# EAGLE schematic Rev B (EAGLE 6.5.0)

## Sheet 1 of 2
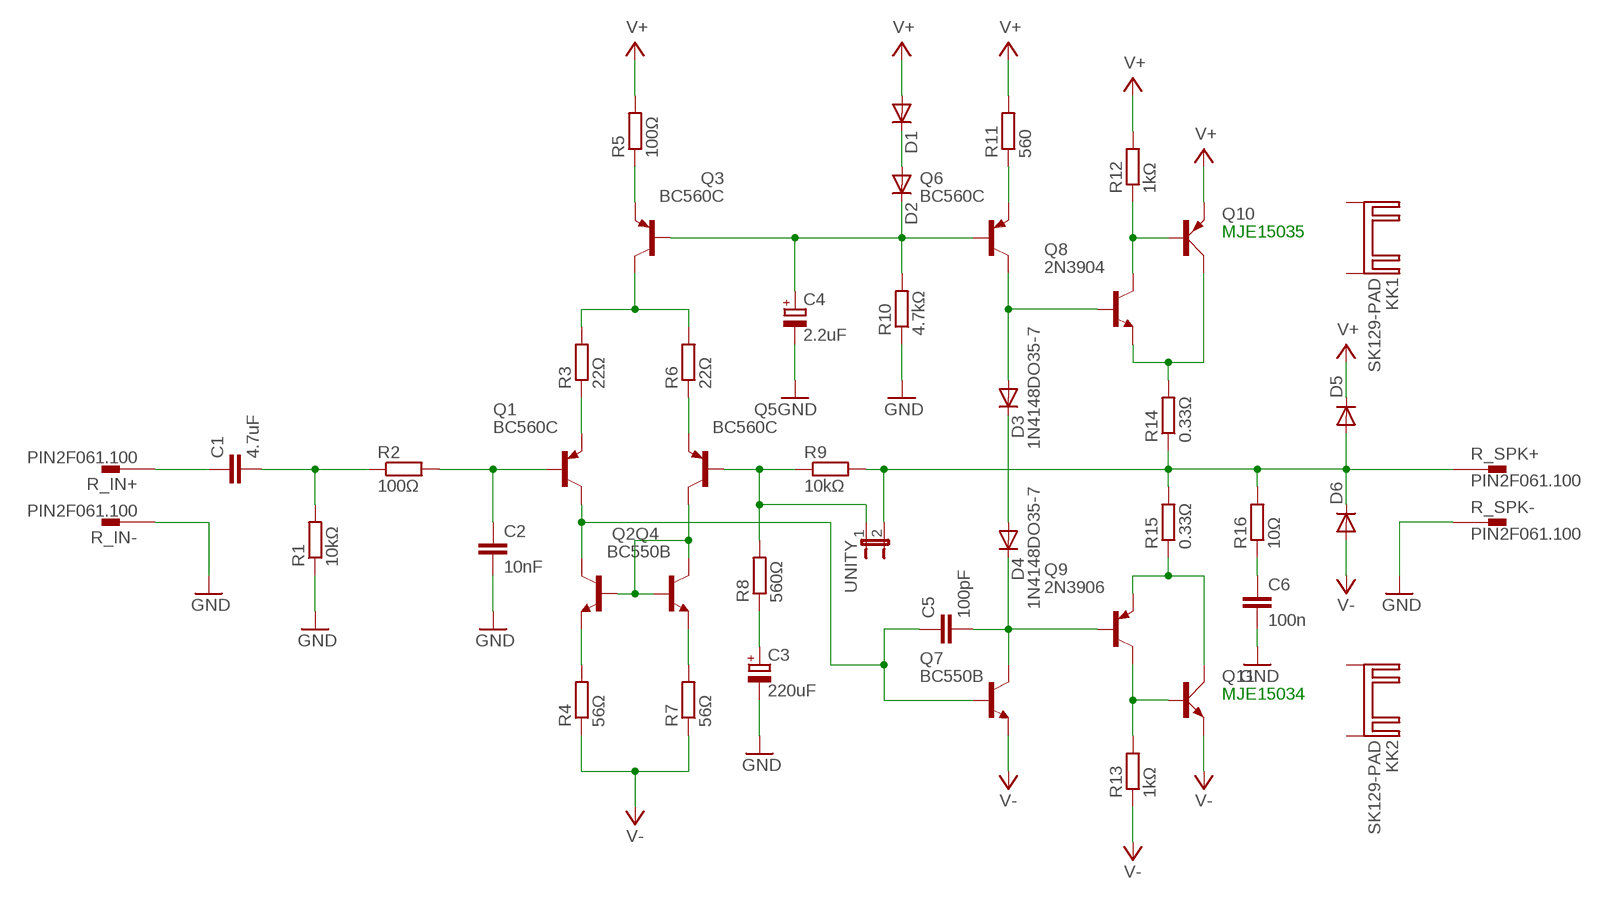
[diagram p0: schematic, sheet 1]

### Parts
C1  4.7uF  C-EU225-113X268  [C225-113X268]
C2  10nF  C-EU025-025X050  [C025-025X050]
C3  220uF  CPOL-EUE3.5-8  [E3,5-8]
C4  2.2uF  CPOL-EUE2-5  [E2-5]
C5  100pF  C-EU050-050X075  [C050-050X075]
C6  100n  C-EU075-042X103  [C075-042X103]
D1  1N4148DO35-7  [DO35-7]
D2  1N4148DO35-7  [DO35-7]
D3  1N4148DO35-7  [DO35-7]
D4  1N4148DO35-7  [DO35-7]
D5  1N4148DO35-7  [DO35-7]
D6  1N4148DO35-7  [DO35-7]
KK1  SK129-PAD  [SK129]
KK2  SK129-PAD  [SK129]
Q1  BC560C  [TO92-EBC]
Q2  BC550B  [TO92-EBC]
Q3  BC560C  [TO92-EBC]
Q4  BC550B  [TO92-EBC]
Q5  BC560C  [TO92-EBC]
Q6  BC560C  [TO92-EBC]
Q7  BC550B  [TO92-EBC]
Q8  2N3904  [TO92]
Q9  2N3906  [TO92]
Q10  TIP42C  [TO220AV]
Q11  TIP41C  [TO220AV]
R1  10kΩ  R-EU_0207/10  [0207/10]
R2  100Ω  R-EU_0207/10  [0207/10]
R3  22Ω  R-EU_0207/10  [0207/10]
R4  56Ω  R-EU_0207/10  [0207/10]
R5  100Ω  R-EU_0207/10  [0207/10]
R6  22Ω  R-EU_0207/10  [0207/10]
R7  56Ω  R-EU_0207/10  [0207/10]
R8  560Ω  R-EU_0207/10  [0207/10]
R9  10kΩ  R-EU_0207/10  [0207/10]
R10  4.7kΩ  R-EU_0207/10  [0207/10]
R11  560  R-EU_0207/10  [0207/10]
R12  1kΩ  R-EU_0207/10  [0207/10]
R13  1kΩ  R-EU_0207/10  [0207/10]
R14  0.33Ω  R-EU_0309/12  [0309/12]
R15  0.33Ω  R-EU_0309/12  [0309/12]
R16  10Ω  R-EU_0617/5V  [0617V]
R_IN+  PIN2F061.100  [F061.100]
R_IN-  PIN2F061.100  [F061.100]
R_SPK+  PIN2F061.100  [F061.100]
R_SPK-  PIN2F061.100  [F061.100]
UNITY  JP1E  [JP1]

### Nets
GND: C2.2 C3.- C4.- C6.2 R1.1 R10.1 R_IN-.A1 R_IN-.A2 R_SPK-.A1 R_SPK-.A2 ; also sheet 2
N$1: D3.A Q6.C Q8.2(B)
N$2: Q5.E R6.1
N$3: Q2.B Q4.B Q4.C Q5.C
N$4: C2.1 Q1.B R2.2
N$5: C1.2 R1.2 R2.1
N$6: C4.+ D2.C Q3.B Q6.B R10.2
N$7: C1.1 R_IN+.A1 R_IN+.A2
N$8: C5.1 Q1.C Q2.C Q7.B
N$9: D1.C D2.A
N$11: Q6.E R11.1
N$12: C3.+ R8.1
N$13: Q2.E R4.2
N$14: Q4.E R7.2
N$16: C6.1 R16.1
N$18: Q1.E R3.1
N$19: Q3.C R3.2 R6.2
N$20: Q3.E R5.1
N$24: D3.C D4.A
N$26: Q8.1(C) Q10.B R12.1
N$27: Q9.1(C) Q11.B R13.2
N$28: Q9.3(E) Q11.C R15.1
N$29: Q8.3(E) Q10.C R14.2
N$31: C5.2 D4.C Q7.C Q9.2(B)
N$32: Q5.B R8.2 R9.1 UNITY.1
R_OUT: D5.A D6.C R9.2 R14.1 R15.2 R16.2 R_SPK+.A1 R_SPK+.A2 UNITY.2
V+: D1.A D5.C Q10.E R5.2 R11.2 R12.2 ; also sheet 2
V-: D6.A Q7.E Q11.E R4.1 R7.1 R13.1 ; also sheet 2
Unconnected: KK1.A2,5(K) KK1.B2,5(K) KK2.A2,5(K) KK2.B2,5(K)

### Notes on the sheet
- MJE15035
- MJE15034

## Sheet 2 of 2
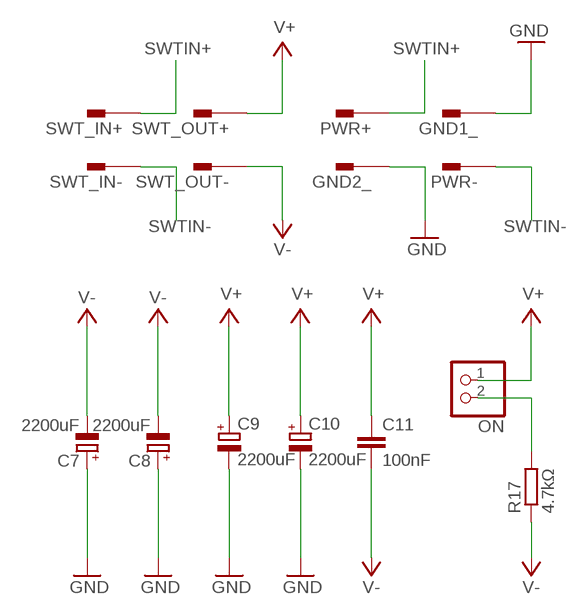
[diagram p1: schematic, sheet 2]

### Parts
C7  2200uF  CPOL-EUE5-10.5  [E5-10,5]
C8  2200uF  CPOL-EUE5-10.5  [E5-10,5]
C9  2200uF  CPOL-EUE5-10.5  [E5-10,5]
C10  2200uF  CPOL-EUE5-10.5  [E5-10,5]
C11  100nF  C-EU025-025X050  [C025-025X050]
GND1_  PIN2F061.100  [F061.100]
GND2_  PIN2F061.100  [F061.100]
ON  JST_2PIN-THM  [JST-PH-2-THM]
PWR+  PIN2F061.100  [F061.100]
PWR-  PIN2F061.100  [F061.100]
R17  4.7kΩ  R-EU_0207/10  [0207/10]
SWT_IN+  PIN2F061.100  [F061.100]
SWT_IN-  PIN2F061.100  [F061.100]
SWT_OUT+  PIN2F061.100  [F061.100]
SWT_OUT-  PIN2F061.100  [F061.100]

### Nets
GND: C7.+ C8.+ C9.- C10.- GND1_.A1 GND1_.A2 GND2_.A1 GND2_.A2 ; also sheet 1
N$10: ON.2 R17.2
SWTIN+: PWR+.A1 PWR+.A2 SWT_IN+.A1 SWT_IN+.A2
SWTIN-: PWR-.A1 PWR-.A2 SWT_IN-.A1 SWT_IN-.A2
V+: C9.+ C10.+ C11.1 ON.1 SWT_OUT+.A1 SWT_OUT+.A2 ; also sheet 1
V-: C7.- C8.- C11.2 R17.1 SWT_OUT-.A1 SWT_OUT-.A2 ; also sheet 1

## Library data of the parts
C1 C2 C5 C6 C11 = rcl:C-EU: CAPACITOR, European symbol
C3 C4 C7-C10 = rcl:CPOL-EU: POLARIZED CAPACITOR, European symbol
D1-D6 = diode:1N4148: DIODE high speed (Philips)
GND1_ GND2_ PWR+ PWR- R_IN+ R_IN- R_SPK+ R_SPK- SWT_IN+ SWT_IN- SWT_OUT+ SWT_OUT- = con-faston:PIN2: Flachstecker Typ Tyco/Electronics/AMP TAB, FASTON Printed Circuit Board Tabs Source: http://www.buerklin.com, http://catalog.tycoelectronics.com; OC_FARNELL: unknown; OC_NEWARK: unknown
KK1 KK2 = heatsink:SK129-PAD: HEATSINK manufacturer Fischer/distributor Buerklin
ON = adafruit:JST_2PIN: JST 2-Pin Connectors of various flavors SMT-RA (S2B-PH-SM4) 4UConnector #17311 SMT (B2B-PH-SM4) THM-RA (S2B-PH) THM (B2B-PH)
Q1 Q3 Q5 Q6 = transistor-pnp:BC560*: PNP Transistror
Q2 Q4 Q7 = transistor-npn:BC550*: NPN Transistor
Q8 = transistor-npn:2N3904: NPN Transistor
Q9 = transistor-pnp:2N3906: PNP Transistor
Q10 = transistor-power:TIP42C: PNP TRANSISTOR
Q11 = transistor-power:TIP41C: NPN TRANSISTOR
R1-R17 = rcl:R-EU_: RESISTOR, European symbol
UNITY = jumper:JP1E: JUMPER